# EAGLE schematic 3_Potes (EAGLE 7.2.0)
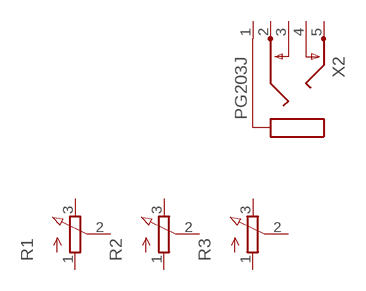
[diagram p0: schematic, sheet 1]

## Parts
R1  3RP/1610N  [3RP/1610N]
R2  3RP/1610N  [3RP/1610N]
R3  3RP/1610N  [3RP/1610N]
X2  PG203J  [PG203J]
Unconnected: R1.1(A) R1.2(S) R1.3(E) R2.1(A) R2.2(S) R2.3(E) R3.1(A) R3.2(S) R3.3(E) X2.1 X2.2 X2.3 X2.4 X2.5

## Library data of the parts
R1-R3 = pot:3RP/1610N: 16mm Potentiometer one level Source: http://www.alphapotentiometers.net/html/16mm_pot_2.html
X2 = con-hirschmann:PG203J: MIC/HEADPHONE JACK KS-S stereo microphone/headphone jack PG203JN (Schukat); OC_FARNELL: unknown; OC_NEWARK: unknown